# EAGLE design nor (EAGLE 9.5.0)
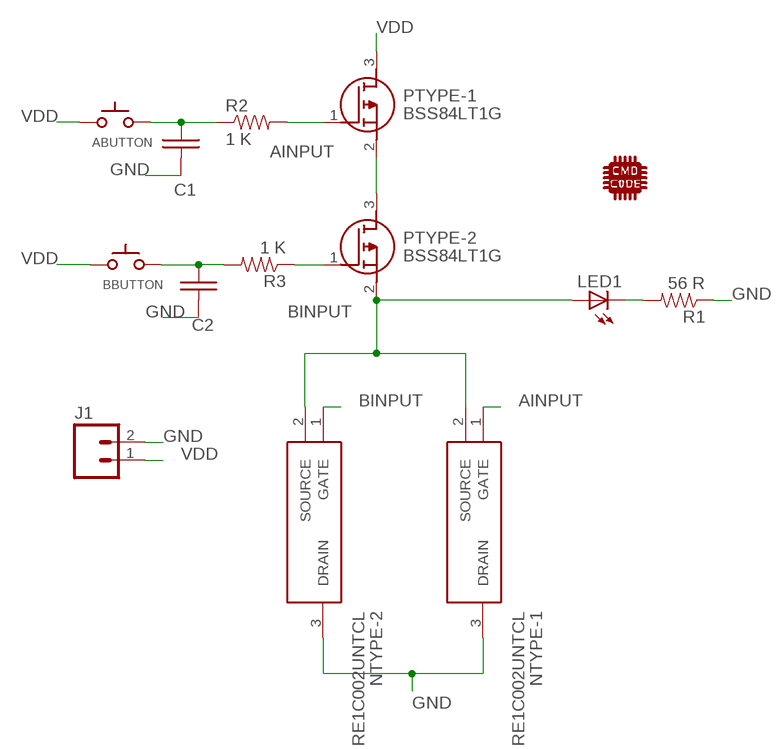
[diagram p0: schematic, sheet 1]

## Parts
ABUTTON  SWITCH_TACTILETACTILE-2PIN-NARROW  [TACTILE-2PIN-NARROW]
BBUTTON  SWITCH_TACTILETACTILE-2PIN-NARROW  [TACTILE-2PIN-NARROW]
C1  C-USC1206  [C1206]
C2  C-USC1206  [C1206]
J1  M021X02_NO_SILK  [1X02_NO_SILK]
LED1  LED3MM  [LED3MM]
NTYPE-1  RE1C002UNTCL  [SOT50P160X85-3N]
NTYPE-2  RE1C002UNTCL  [SOT50P160X85-3N]
PTYPE-1  BSS84LT1G  [SOT96P237X111-3N]
PTYPE-2  BSS84LT1G  [SOT96P237X111-3N]
R1  56 R  RESISTOR1206  [1206]
R2  1 K  RESISTOR0805-RES  [0805]
R3  1 K  RESISTOR0805-RES  [0805]
U$1  CMD_C0DE_LOGOCMD_CODE_LOGO_TOP_COPPER  [CMD_C0DE_LOGO_TOP_COPPER]

## Nets
AINPUT: NTYPE-1.1(GATE) PTYPE-1.1(G) R2.2
BINPUT: NTYPE-2.1(GATE) PTYPE-2.1(G) R3.1
GND: C1.2 C2.2 J1.2 NTYPE-1.3(DRAIN) NTYPE-2.3(DRAIN) R1.1
N$1: ABUTTON.P$1(A) C1.1 R2.1
N$2: PTYPE-1.2(S) PTYPE-2.3(D)
N$3: LED1.A NTYPE-1.2(SOURCE) NTYPE-2.2(SOURCE) PTYPE-2.2(S)
N$4: LED1.K(C) R1.2
N$6: BBUTTON.P$1(A) C2.1 R3.2
VDD: ABUTTON.P$2(C) BBUTTON.P$2(C) J1.1 PTYPE-1.3(D)

## Library data of the parts
ABUTTON BBUTTON = switches:SWITCH_TACTILE
C1 C2 = passives:C-US: CAPACITOR, American symbol
J1 = connector:M02: Standard 2-pin 0.1" header. Use with - straight break away headers ( PRT-00116) - right angle break away headers (PRT-00553) - swiss pins (PRT-00743) - machine pins (PRT-00117) - female headers (PRT-00115) Molex polarized connector foot print use with: PRT-08233 with associated crimp pins and housings. 2.54_SCREWTERM for use with PRT-10571. 3.5mm Screw Terminal footprints for PRT-08084 5mm Screw Terminal footprints for use with PRT-08432
LED1 = leds:LED: LEDs Standard schematic elements and footprints for 5mm, 3mm, 1206, and 0603 sized LEDs. 5mm - Spark Fun Electronics SKU : COM-00529 (and others)
NTYPE-1 NTYPE-2 = transitors:RE1C002UNTCL: MOSFET 1.2V Drive Nch MOSFET Source: Datasheet <https://componentsearchengine.com/Datasheets/1/RE1C002UNTCL.pdf>; DESCRIPTION: MOSFET 1.2V Drive Nch MOSFET; HEIGHT: 0.85mm; MANUFACTURER_NAME: ROHM Semiconductor; MANUFACTURER_PART_NUMBER: RE1C002UNTCL; MOUSER_PART_NUMBER: 755-RE1C002UNTCL; MOUSER_PRICE-STOCK: https://www.mouser.com/Search/Refine.aspx?Keyword=755-RE1C002UNTCL
PTYPE-1 PTYPE-2 = transitors:BSS84LT1G: MOSFET 50V 130mA P-Channel Source: Datasheet <https://componentsearchengine.com/Datasheets/1/BSS84LT1G.pdf>; DESCRIPTION: MOSFET 50V 130mA P-Channel; HEIGHT: 1.11mm; MANUFACTURER_NAME: ON Semiconductor; MANUFACTURER_PART_NUMBER: BSS84LT1G; MOUSER_PART_NUMBER: 863-BSS84LT1G; MOUSER_PRICE-STOCK: https://www.mouser.com/Search/Refine.aspx?Keyword=863-BSS84LT1G
R1-R3 = passives:RESISTOR: Resistor Basic schematic elements and footprints for 0603, 1206, and PTH resistors.
U$1 = logos:CMD_C0DE_LOGO

## Board
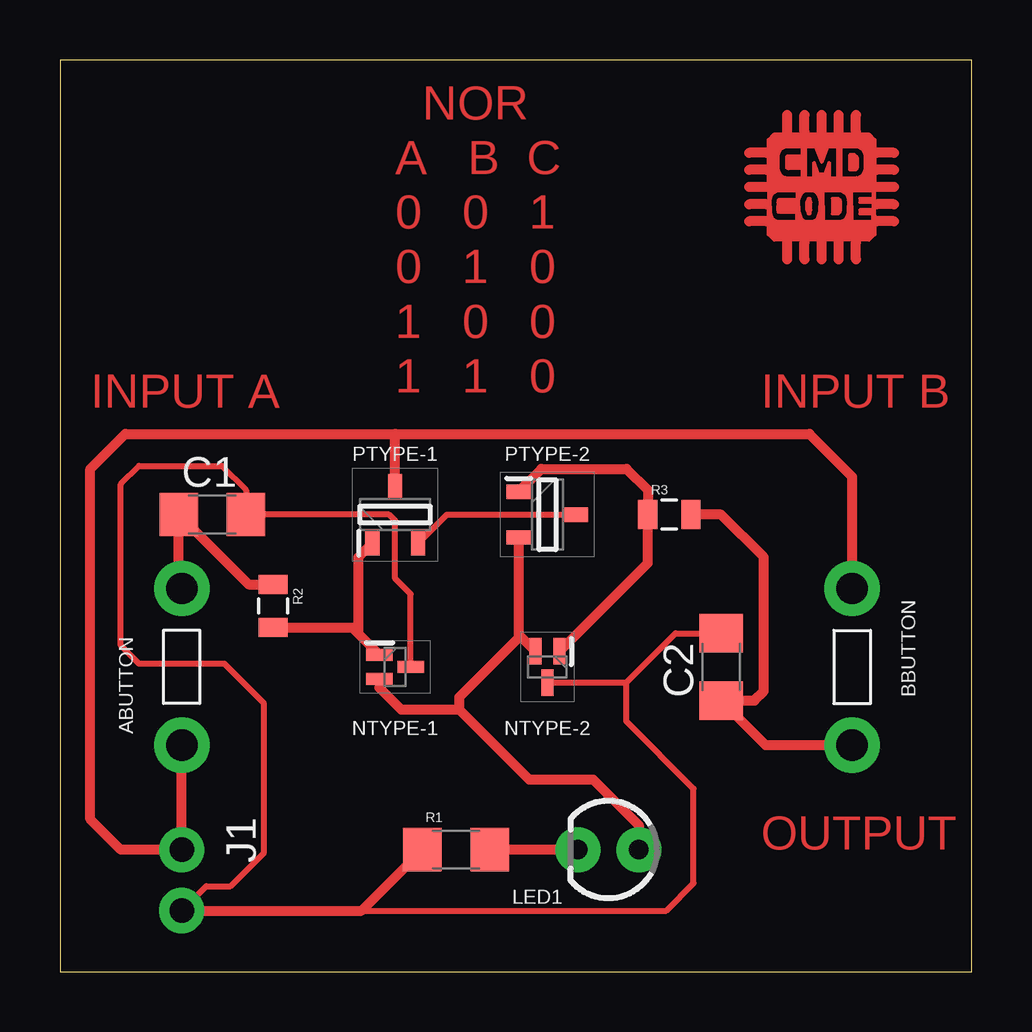
[diagram p1: board, top side]

Size 38 x 38 mm. Coordinates in mm from the lower left corner, seen from the top.
Outline: 0,0 38,0 38,38 0,38 0,0
Copper layers (1*16): Top 0.035mm / dielectric 1.5mm / Bottom 0.035mm
Design rules "default": minimum track width 6mil, minimum drill 0.35mm, track to track 6mil, track to pad 6mil, pad to pad 6mil, via to via 6mil, smd to smd 6mil, copper to edge 40mil, drill to drill 6mil, minimum pad ring 10mil, minimum via ring 8mil, stop-mask expansion 4mil, vias tented up to drill 0mil, thermal gap 10mil

### Footprints (pad centres in the part's own frame; a part is rotated, then mirrored left to right if it is on the bottom)
TACTILE-2PIN-NARROW = drill 1.3 pad 2.3: P$1 3.264,0; P$2 -3.264,0
C1206 = smd 1.6 x 1.8: 1 -1.4,0; 2 1.4,0
1X02_NO_SILK = drill 1.016 pad 1.88: 1 0,0; 2 2.54,0
LED3MM = drill 0.813 pad 1.88: A -1.27,0; K 1.27,0
SOT50P160X85-3N = smd 1.1 x 0.5: 1 -0.65,0.5; 2 -0.65,-0.5; 3 0.65,0
SOT96P237X111-3N = smd 1 x 0.6: 1 -1.2,0.955; 2 -1.2,-0.955; 3 1.2,0
1206 = smd 1.6 x 1.8: 1 -1.4,0; 2 1.4,0
0805 = smd 0.8 x 1.2: 1 -0.9,0; 2 0.9,0

### Placement (x,y rotation side)
ABUTTON  5.08,12.7 90 top
BBUTTON  33.02,12.7 270 top
C1  6.35,19.05 0 top
C2  27.56,12.7 90 top
J1  5.08,5.08 270 top
LED1  22.86,5.08 180 top
NTYPE-1  13.97,12.7 0 top
NTYPE-2  20.32,12.7 270 top
PTYPE-1  13.97,19.05 90 top
PTYPE-2  20.32,19.05 0 top
R1  16.51,5.08 0 top
R2  8.89,15.24 270 top
R3  25.4,19.05 0 top
U$1  31.75,33.02 0 top

### Tracks (layer width: path | path; a pad name or v marks a point on that pad's centre or on a via)
AINPUT
  Top 0.406: R2.2 12.18,14.34 NTYPE-1.1 12.43,14.09 12.43,17.27 PTYPE-1.1
BINPUT
  Top 0.406: PTYPE-2.1 20.07,20.95 23.62,20.95 24.5,20.08 R3.1 24.5,17.03 NTYPE-2.1
GND
  Top 0.254: NTYPE-2.3 23.61,12.05 | C2.2 25.66,14.1 23.61,12.05 | 12.57,2.54 25.27,2.54 26.42,3.68 26.42,7.62 23.61,10.43 23.61,12.05 | J1.2 6.1,3.56 7.11,3.56 8.51,4.95 8.51,11.18 6.86,12.83 3.3,12.83 2.54,13.59 2.54,20.32 3.3,21.08 6.73,21.08 7.75,20.06 C1.2 13.72,19.05 13.97,18.8 13.97,16.38 14.62,15.73 NTYPE-1.3
  Top 0.406: J1.2 12.57,2.54 R1.1
N$1
  Top 0.406: ABUTTON.P$1 4.95,16.09 C1.1 7.86,16.14 R2.1
N$2
  Top 0.254: PTYPE-1.2 16.12,19.05 PTYPE-2.3
N$3
  Top 0.406: PTYPE-2.2 19.12,14.05 | 19.12,14.05 NTYPE-2.2 | 19.12,14.05 19.12,13.91 16.64,11.43 16.64,10.92 | LED1.A 24.13,6.1 22.23,8 19.56,8 16.64,10.92 | NTYPE-1.2 13.32,11.83 14.22,10.92 16.64,10.92
N$4
  Top 0.406: LED1.K R1.2
N$6
  Top 0.406: BBUTTON.P$1 29.42,9.44 C2.1 28.95,11.3 29.34,11.68 29.34,17.27 27.56,19.05 R3.2
VDD
  Top 0.406: 13.97,22.41 2.73,22.41 1.27,20.95 1.27,6.35 2.54,5.08 J1.1 ABUTTON.P$2 | 13.97,22.41 31.24,22.41 33.02,20.63 BBUTTON.P$2 | PTYPE-1.3 13.97,22.41

### Text on the board
Top: INPUT A | NOR / A B C / 0 0 1 / 0 1 0 / 1 0 0 / 1 1 0 | INPUT B | OUTPUT